# EAGLE design main (EAGLE 7.4.0)
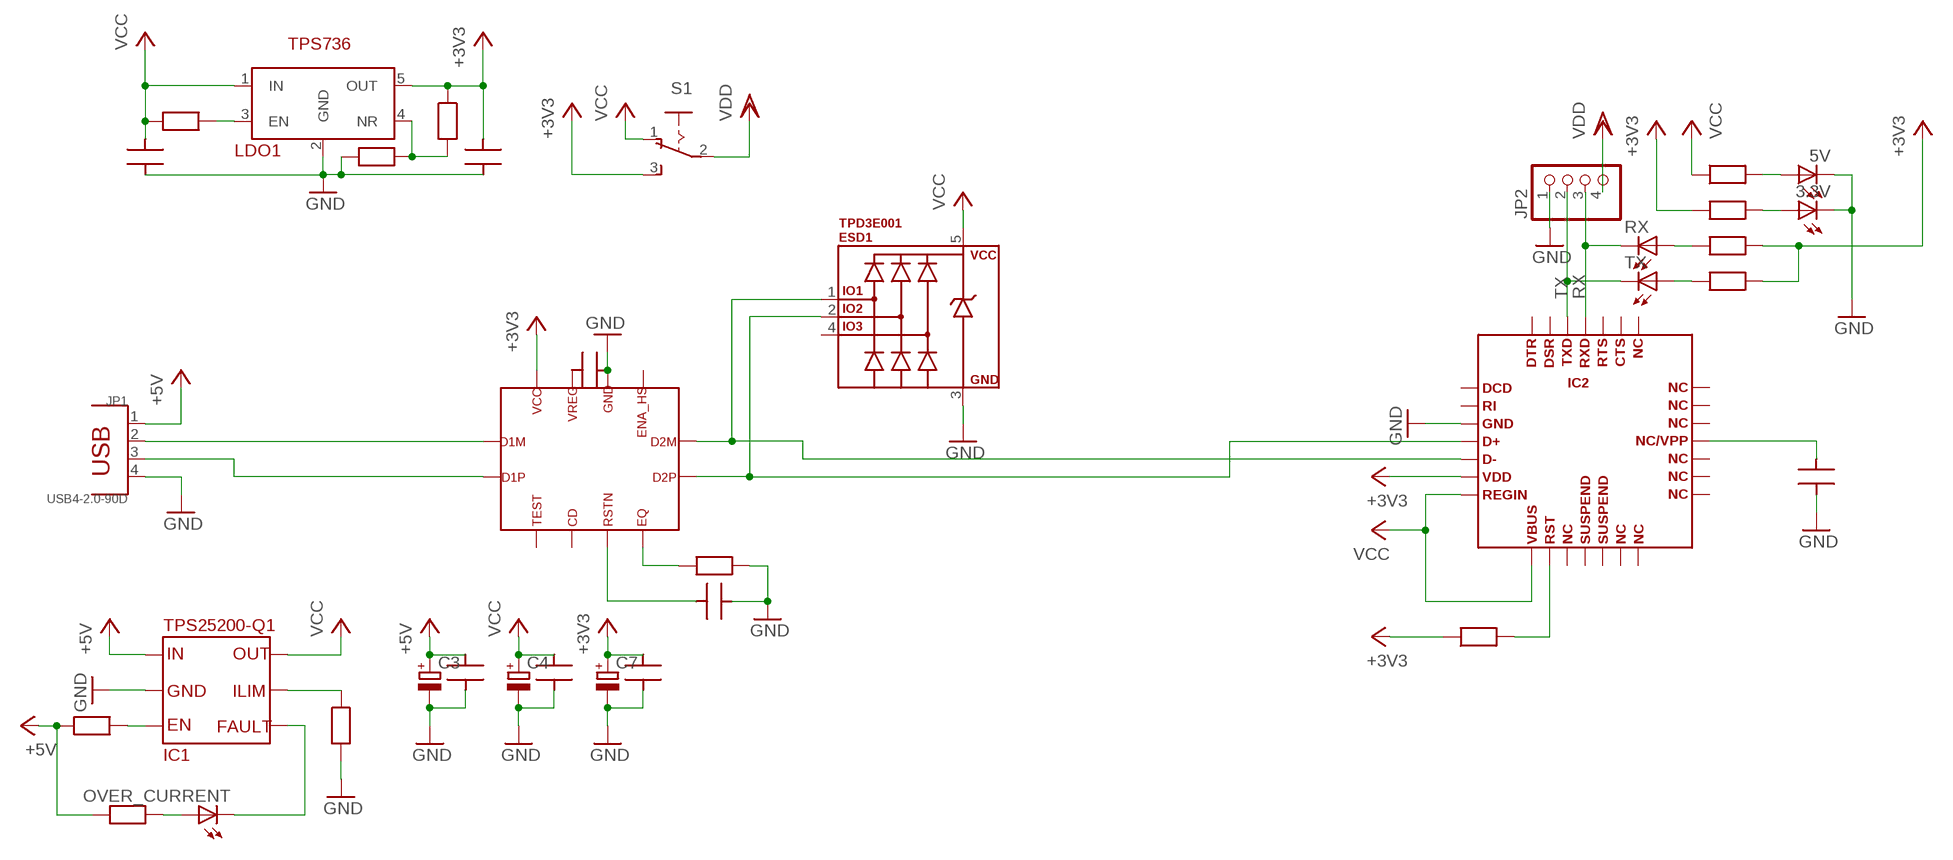
[diagram p0: schematic, sheet 1]

## Parts
3.3V  LEDCHIP-LED0603  [CHIP-LED0603]
5V  LEDCHIP-LED0603  [CHIP-LED0603]
C1  CAP0603  [C0603]
C2  CAP0603  [C0603]
C3  CPOL-EUSMCA  [SMC_A]
C4  CPOL-EUSMCA  [SMC_A]
C5  CAP0603  [C0603]
C6  CAP0603  [C0603]
C7  CPOL-EUSMCA  [SMC_A]
C8  CAP0603  [C0603]
C9  CAP0603  [C0603]
C10  CAP0603  [C0603]
C11  CAP0603  [C0603]
ESD1  TPD3E001  [SOT23-5]
IC1  TPS25200-Q1  [PWSON6]
IC2  CP2102/9  [QFN-28]
JP1  USB4-2.0-90D  DIP-USB-A-TYPE-FMAL(4+2P-2.0-90D)  [USB4+2P-2.0-90D]
JP2  PINHD-1X4  [1X04]
LDO1  TPS736  [SOT23-5]
OVER_CURRENT  LEDCHIP-LED0603  [CHIP-LED0603]
R1  RES0603  [R0603]
R2  RES0603  [R0603]
R3  RES0603  [R0603]
R4  RES0603  [R0603]
R5  RES0603  [R0603]
R6  RES0603  [R0603]
R7  RES0603  [R0603]
R8  RES0603  [R0603]
R9  RES0603  [R0603]
R10  RES0603  [R0603]
R11  RES0603  [R0603]
R12  RES0603  [R0603]
RX  LEDCHIP-LED0603  [CHIP-LED0603]
S1  255SB  [255SB]
TX  LEDCHIP-LED0603  [CHIP-LED0603]
USB1  TUSB211QRWBRQ1  [X2QFN]

## Nets
+3V3: C2.2 C7.+ C8.2 IC2.6 LDO1.5(OUT) R2.1 R7.1 R8.2 R9.2 R10.1 S1.3(S) USB1.12
+5V: C3.+ C5.2 IC1.P$1 JP1.1 R4.2 R12.1
GND: 3.3V.C 5V.C C1.1 C2.1 C3.- C4.- C5.1 C6.1 C7.- C8.1 C9.1 C10.1 C11.2 ESD1.3 IC1.EPAD IC1.P$2 IC2.3 IC2.EPAD_B IC2.EPAD_T IC2.EPAD_VIA1 IC2.EPAD_VIA2 IC2.EPAD_VIA3 IC2.EPAD_VIA4 IC2.EPAD_VIA5 IC2.EPAD_VIA6 IC2.EPAD_VIA7 IC2.EPAD_VIA8 IC2.EPAD_VIA9 JP1.4 JP2.1 LDO1.2(GND) R3.1 R5.2 R6.2 USB1.10
N$1: JP1.2 USB1.1
N$2: JP1.3 USB1.2
N$3: LDO1.3(EN) R1.1
N$4: LDO1.4(NR) R2.2 R3.2
N$5: IC1.P$3 R4.1
N$6: IC1.P$5 R5.1
N$7: ESD1.1 IC2.5 USB1.8
N$8: ESD1.2 IC2.4 USB1.7
N$9: C9.2 USB1.11
N$10: R6.1 USB1.6
N$11: C10.2 USB1.5
N$12: IC2.9 R7.2
N$13: R8.1 RX.A
N$14: R9.1 TX.A
N$15: C11.1 IC2.18
N$16: 3.3V.A R10.2
N$17: OVER_CURRENT.A R12.2
N$18: IC1.P$4 OVER_CURRENT.C
N$19: 5V.A R11.2
RX: IC2.25 JP2.3 RX.C
TX: IC2.26 JP2.2 TX.C
VCC: C1.2 C4.+ C6.2 ESD1.5 IC1.P$6 IC2.7 IC2.8 LDO1.1(IN) R1.2 R11.1 S1.1(O)
VDD: JP2.4 S1.2(P)
Unconnected: ESD1.4 IC2.1 IC2.2 IC2.10 IC2.11 IC2.12 IC2.13 IC2.14 IC2.15 IC2.16 IC2.17 IC2.19 IC2.20 IC2.21 IC2.22 IC2.23 IC2.24 IC2.27 IC2.28 JP1.SG1(GND) JP1.SG2(GND) USB1.3 USB1.4 USB1.9

## Library data of the parts
3.3V 5V OVER_CURRENT RX TX = led:LED: LED OSRAM: - CHIPLED LG R971, LG N971, LY N971, LG Q971, LY Q971, LO R971, LY R971 LH N974, LH R974 LS Q976, LO Q976, LY Q976 LO Q996 - Hyper CHIPLED LW Q18S LB Q993, LB Q99A, LB R99A - SideLED LS A670, LO A670, LY A670, LG A670, LP A670 LB A673, LV A673, LT A673, LW A673 LH A674 LY A675 LS A676, LA A676, LO A676, LY A676, LW A676 LS A679, LY A679, LG A679 - Hyper Micro SIDELED® LS Y876, LA Y876, LO Y876, LY Y876 LT Y87S - SmartLED LW L88C, LW L88S LB L89C, LB L89S, LG L890 LS L89K, LO L89K, LY L89K LS L896, LA L896, LO L896, LY L896 - TOPLED LS T670, LO T670, LY T670, LG T670, LP T670 LSG T670, LSP T670, LSY T670, LOP T670, LYG T670 LG T671, LOG T671, LSG T671 LB T673, LV T673, LT T673, LW T673 LH T674 LS T676, LA T676, LO T676, LY T676, LB T676, LH T676, LSB T676, LW T676 LB T67C, LV T67C, LT T67C, LS T67K, LO T67K, LY T67K, LW E67C LS E67B, LA E67B, LO E67B, LY E67B, LB E67C, LV E67C, LT E67C LW T67C LS T679, LY T679, LG T679 LS T770, LO T770, LY T770, LG T770, LP T770 LB T773, LV T773, LT T773, LW T773 LH T774 LS E675, LA E675, LY E675, LS T675 LS T776, LA T776, LO T776, LY T776, LB T776 LHGB T686 LT T68C, LB T68C - Hyper Mini TOPLED® LB M676 - Mini TOPLED Santana® LG M470 LS M47K, LO M47K, LY M47K Source: http://www.osram.convergy.de LUXEON: - LUMILED® LXK2-PW12-R00, LXK2-PW12-S00, LXK2-PW14-U00, LXK2-PW14-V00 LXK2-PM12-R00, LXK2-PM12-S00, LXK2-PM14-U00 LXK2-PE12-Q00, LXK2-PE12-R00, LXK2-PE12-S00, LXK2-PE14-T00, LXK2-PE14-U00 LXK2-PB12-K00, LXK2-PB12-L00, LXK2-PB12-M00, LXK2-PB14-N00, LXK2-PB14-P00, LXK2-PB14-Q00 LXK2-PR12-L00, LXK2-PR12-M00, LXK2-PR14-Q00, LXK2-PR14-R00 LXK2-PD12-Q00, LXK2-PD12-R00, LXK2-PD12-S00 LXK2-PH12-R00, LXK2-PH12-S00 LXK2-PL12-P00, LXK2-PL12-Q00, LXK2-PL12-R00 Source: www.luxeon.com KINGBRIGHT: KA-3528ASYC Source: www.kingbright.com
C1 C2 C5 C6 C8-C11 = My_RLC:CAP0603: Ceramic Capasitor SMD 0603
C3 C4 C7 = rcl:CPOL-EU: POLARIZED CAPACITOR, European symbol
ESD1 = My_TI:TPD3E001: TPD3E001 Low-Capacitance 3-Channel ESD-Protection for High-Speed Data Interfaces. IEC61000-4-2 Level-4 ESD Protection: – ±8-kV IEC 61000-4-2 Contact Discharge. – ±15-kV IEC 61000-4-2 Air-Gap Discharge. 5.5-A Peak Pulse Current (8/20-µs Pulse). 0.9-V to 5.5-V Supply-Voltage Range. Datasheet <http://www.ti.com/lit/ds/symlink/tpd3e001.pdf>
IC1 = My_TI:TPS25200-Q1: TPS25200-Q1 5-V eFuse With Precision Adjustable Current Limit and Overvoltage Clamp. Datasheet <http://www.ti.com/lit/ds/symlink/tps25200-q1.pdf>
IC2 = Interface:CP2102/9: CP2102/9 SINGLE-CHIP USB TO UART BRIDGE. Integrated USB transceiver; no external resistors requied. Integrated clock; no external crystal required. Internal 1024-byte programmable ROM for vendor ID product ID, serial number, power descriptor, release number, and product description strings. - EEPROM (CP2102). - EPROM (One-time programmable) (CP2109). Datasheet <https://www.silabs.com/Support%20Documents/TechnicalDocs/CP2102-9.pdf>
JP1 = Seeed-OPL-Connector:DIP-USB-A-TYPE-FMAL(4+2P-2.0-90D): 320010007
JP2 = pinhead:PINHD-1X4: PIN HEADER
LDO1 = My_TI:TPS736: TPS73632DBVT Cap-Free, NMOS, 400-mA Low-Dropout Regulator with Reverse Current Protection Input Voltage Range of 1.7 V to 5.5 V Ultra-Low Dropout Voltage: 75 mV typ Low Noise: 30 μVRMS typ (10 Hz to 100 kHz) Dtasheet <http://www.ti.com/lit/ds/symlink/tps736.pdf>
R1-R12 = My_RLC:RES0603: Resistor SMD 0603
S1 = switch:255SB: SLIDING SWITCH Distributor Buerklin, 11G810
USB1 = My_TI:TUSB211QRWBRQ1: TUSB211 USB 2.0 High Speed Signal Conditioner Compatible with USB 2.0, OTG 2.0 and BC 1.2 Active Power Consumption of 55 mW (Typical) with 3.3-V Single Supply Datasheet <http://www.ti.com/lit/ds/symlink/tusb211-q1.pdf>

## Board
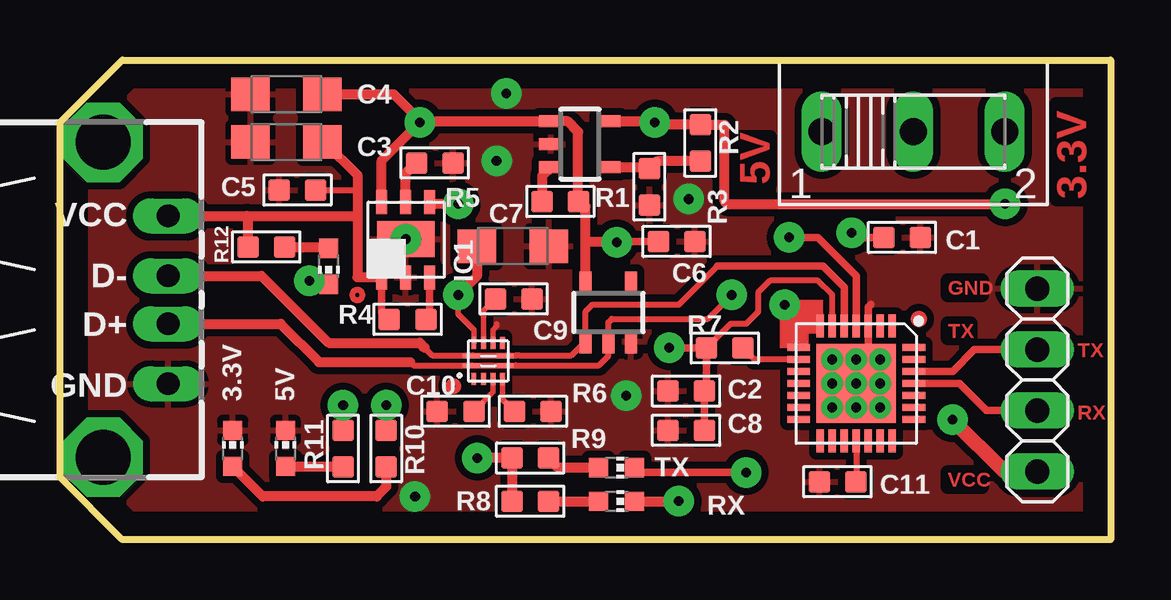
[diagram p1: board, top side]
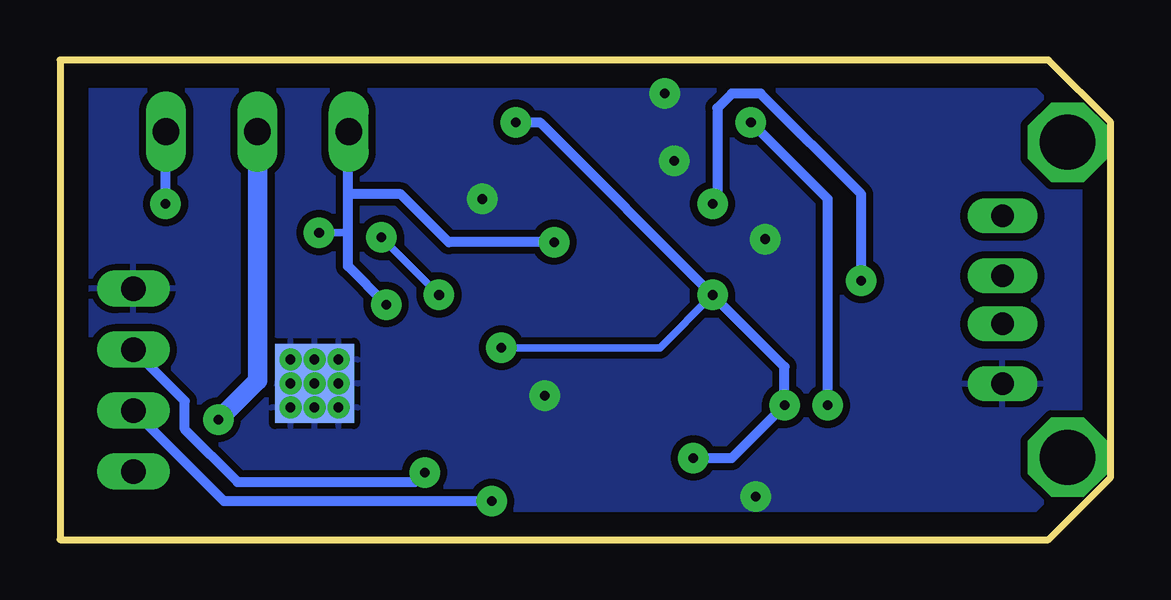
[diagram p2: board, bottom side, seen from below]

Size 43.8 x 20 mm. Coordinates in mm from the lower left corner, seen from the top.
Outline: 0,2.6 0,17.4 2.6,20 43.8,20 43.8,0 2.6,0 0,2.6
Copper layers (1*16): Top 0.035mm / dielectric 1.5mm / Bottom 0.035mm
Design rules "default": minimum track width 10mil, minimum drill 24mil, track to track 8mil, track to pad 8mil, pad to pad 8mil, via to via 8mil, smd to smd 8mil, copper to edge 40mil, drill to drill 8mil, minimum pad ring 10mil, minimum via ring 8mil, stop-mask expansion 4mil, vias tented up to drill 0mil, thermal gap 10mil

### Footprints (pad centres in the part's own frame; a part is rotated, then mirrored left to right if it is on the bottom)
CHIP-LED0603 = smd 0.8 x 0.8: A 0,-0.75; C 0,0.75
C0603 = smd 0.889 x 0.889: 1 0,0.762; 2 0,-0.762
SMC_A = smd 1.6 x 1.4: + -1.5,0; - 1.5,0
SOT23-5 = smd 0.5 x 1: 1 -0.95,-1.2; 2 0,-1.2; 3 0.95,-1.2; 4 0.95,1.2; 5 -0.95,1.2
PWSON6 = smd 1.5 x 2.4: EPAD 0,0 | smd 1 x 0.45: P$1 -1.6,1; P$2 -1.6,0; P$3 -1.6,-1; P$4 1.55,-1; P$5 1.55,0; P$6 1.55,1
QFN-28 = smd 0.95 x 0.3: 1 -2.4,1.5; 2 -2.4,1; 3 -2.4,0.5; 4 -2.4,0; 5 -2.4,-0.5; 6 -2.4,-1; 7 -2.4,-1.5; 15 2.4,-1.5; 16 2.4,-1; 17 2.4,-0.5; 18 2.4,0; 19 2.4,0.5; 20 2.4,1; 21 2.4,1.5 | smd 0.3 x 0.95: 8 -1.5,-2.4; 9 -1,-2.4; 10 -0.5,-2.4; 11 0,-2.4; 12 0.5,-2.4; 13 1,-2.4; 14 1.5,-2.4; 22 1.5,2.4; 23 1,2.4; 24 0.5,2.4; 25 0,2.4; 26 -0.5,2.4; 27 -1,2.4; 28 -1.5,2.4 | smd 3.3 x 3.3 bottom: EPAD_B 0,0 | smd 3.3 x 3.3: EPAD_T 0,0 | drill 0.4: EPAD_VIA1 -1,1; EPAD_VIA2 0,1; EPAD_VIA3 1,1; EPAD_VIA4 1,0; EPAD_VIA5 0,0; EPAD_VIA6 -1,0; EPAD_VIA7 -1,-1; EPAD_VIA8 0,-1; EPAD_VIA9 1,-1
USB4+2P-2.0-90D = drill 0.95 long: 1 -3.5,2.71; 2 -1,2.71; 3 1,2.71; 4 3.5,2.71 | drill 2.3 octagon: SG1 -6.57,0; SG2 6.57,0
1X04 = drill 1.016 long: 1 -3.81,0; 2 -1.27,0; 3 1.27,0; 4 3.81,0
R0603 = smd 0.889 x 0.889: 1 0,0.762; 2 0,-0.762
255SB = drill 1.118 long: 1 -3.81,0; 2 0,0; 3 3.81,0
X2QFN = smd 0.7 x 0.2: 1 -0.7,0.2; 2 -0.7,-0.2; 7 0.7,-0.2; 8 0.7,0.2 | smd 0.2 x 0.5: 3 -0.6,-0.75; 4 -0.2,-0.75; 5 0.2,-0.75; 6 0.6,-0.75; 9 0.6,0.75; 10 0.2,0.75; 11 -0.2,0.75; 12 -0.6,0.75

### Placement (x,y rotation side)
3.3V  7.2,3.8 0 top
5V  9.4,3.8 0 top
C1  35.1,12.6 270 top
C2  26.1,6.19 90 top
C3  9.44,16.58 180 top
C4  9.44,18.57 180 top
C5  9.9,14.58 90 top
C6  25.7,12.43 270 top
C7  18.88,12.23 0 top
C8  26.1,4.56 90 top
C9  18.91,10.04 270 top
C10  16.49,5.35 90 top
C11  32.41,2.41 270 top
ESD1  22.86,9.47 0 top
IC1  14.41,12.53 90 top
IC2  33.19,6.51 270 top
JP1  1.8,10 270 top
JP2  40.74,6.65 270 top
LDO1  21.67,16.49 270 top
OVER_CURRENT  11.2,11.4 180 top
R1  20.86,14.1 90 top
R2  26.69,16.54 0 top
R3  24.57,14.71 180 top
R4  14.49,9.18 270 top
R5  15.62,15.7 90 top
R6  19.71,5.35 90 top
R7  27.71,7.99 90 top
R8  19.6,1.6 270 top
R9  19.6,3.4 270 top
R10  13.6,3.8 0 top
R11  11.8,3.8 0 top
R12  8.6,12.2 90 top
RX  23.2,1.6 270 top
S1  35.57,17.01 0 top
TX  23.2,3 270 top
USB1  17.85,7.45 0 top

### Tracks (layer width: path | path; a pad name or v marks a point on that pad's centre or on a via)
+3V3  (via drill 0.4 pad 1.27)
  Top 0.22: v16.6,10.2 16.6,9.4 17.25,8.75 USB1.12
  Top 0.254: IC2.6 32.19,10.21 31.6,10.8 29.6,10.8 29.1,10.3 29.1,9.5 28.6,9 27.96,9 R7.1
  Top 0.305: v25.4,8 v25.41,7.99 R7.1 26.95,6.28 C2.2 C8.2
  Top 0.406: LDO1.5 24.76,17.44 v24.8,17.4 24.9,17.3 R2.1 27.7,17.3 27.7,14.1 27.8,14 v39.4,14 | C7.+ 17.38,10.98 v16.6,10.2 | R10.1 v13.6,5.6 | R8.2 R9.2 v17.4,3.4
  Bottom 0.305: v25.4,8 18.8,8 v16.6,10.2
  Bottom 0.406: v24.8,17.4 23.8,17.4 v16.6,10.2 13.6,7.2 v13.6,5.6 15.8,3.4 v17.4,3.4 | v39.4,14 39.4,16.99 S1.3
+5V
  Top 0.254: C5.2 12.38,14.58 12.4,14.6
  Top 0.305: IC1.P$1 13.41,9.5 R4.2
  Top 0.406: IC1.P$1 12.4,10.93 12.4,13.4 | C3.+ 11.02,16.58 12.4,15.2 12.4,14.6 12.4,13.4 | JP1.1 7.8,13.5 | 7.8,13.5 12.3,13.5 12.4,13.4 | R12.1 7.84,13.46 7.8,13.5
  Bottom 0.406: 5,13.99 JP1.1
GND  (via drill 0.4 pad 1.27)
  Top 0.22: USB1.10 18.05,8.75 18.2,8.9 18.2,9
  Top 0.305: 33.8,9.8 33.69,9.69 IC2.3 33.69,8.14 33.68,8.13 33.68,7.14 33.31,7.51 IC2.EPAD_VIA6 | IC2.EPAD_VIA6 IC2.EPAD_VIA1 | IC2.EPAD_VIA6 IC2.EPAD_VIA7 | IC2.EPAD_VIA8 IC2.EPAD_VIA9 | IC2.EPAD_VIA4 IC2.EPAD_VIA3
  other vias: 18.2,15.8 26.2,14.2 23.6,6 14.8,1.8 14.41,12.53 18.6,18.6
  pour Top (isolate 0.3): 0,20 43.8,20 43.8,0 0,0
  pour Bottom (isolate 0.3): 43.8,20 0,20 0,0 43.8,0
N$1
  Top 0.1: USB1.1 17.18,7.68 17.2,7.68
  Top 0.254: 15.2,8 15.52,7.68 17.2,7.68 19.05,7.68
  Top 0.406: JP1.2 8.4,11 11.2,8.2 15,8.2 15.2,8
N$2
  Top 0.1: USB1.2 17.17,7.27
  Top 0.254: 14.6,7.4 14.73,7.27 17.17,7.27 19,7.27
  Top 0.406: JP1.3 9.2,9 10.8,7.4 14.6,7.4
N$3
  Top 0.406: LDO1.3 20.1,15.17 R1.1
N$4
  Top 0.406: LDO1.4 24.5,15.54 R3.2 24.88,15.78 R2.2
N$5
  Top 0.305: IC1.P$3 15.41,9.34 R4.1
N$6
  Top 0.406: IC1.P$5 14.41,15.25 R5.1
N$7
  Top 0.1: USB1.8 18.58,7.68 19.03,7.68
  Top 0.254: 27.4,11.4 25.8,9.8 22.2,9.8 21.91,9.51 ESD1.1 21.32,7.68 19.13,7.68 19.03,7.68
  Top 0.305: 27.4,11.4 31.8,11.4 32.69,10.51 IC2.5
N$8  (via drill 0.4 pad 1.27)
  Top 0.1: USB1.7 18.57,7.27 19,7.27
  Top 0.254: v28,10.2 27,9.2 23,9.2 22.86,9.06 ESD1.2 22.86,7.66 22.47,7.27 19,7.27
  Top 0.305: IC2.4 33.2,11 31.6,12.6 v30.4,12.6
  Bottom 0.305: v28,10.2 v30.4,12.6
N$9
  Top 0.22: USB1.11 17.65,9.54 C9.2
N$10
  Top 0.22: USB1.6 18.45,5.85 R6.1
N$11
  Top 0.22: USB1.5 18.05,6.15 C10.2
N$12
  Top 0.254: IC2.9 28.95,7.51 R7.2
N$13
  Top 0.406: R8.1 RX.A
N$14
  Top 0.406: TX.A 20.76,3 R9.1
N$15
  Top 0.254: IC2.18 33.19,2.43 C11.1
N$16
  Top 0.406: R10.2 13.6,2.2 13.2,1.8 8.45,1.8 3.3V.A
N$17
  Top 0.406: R12.2 11.15,12.2 OVER_CURRENT.A
N$18  (via drill 0.4 pad 1.27)
  Top 0.406: OVER_CURRENT.C 10.55,10.65 v10.4,10.8 | v16.6,14 15.49,14 IC1.P$4
  Bottom 0.406: v10.4,10.8 10.4,14.4 14.6,18.6 15.8,18.6 16.4,18 16.4,14.2 v16.6,14
N$19
  Top 0.406: R11.2 9.41,3.04 5V.A
RX  (via drill 0.4 pad 1.27)
  Top 0.305: IC2.25 37.49,6.51 38.62,5.38 JP2.3
  Top 0.406: RX.C v25.8,1.6
  Bottom 0.406: v25.8,1.6 36.96,1.6 JP2.3
TX  (via drill 0.4 pad 1.27)
  Top 0.305: IC2.26 37.21,7.01 38.12,7.92 JP2.2 | TX.C 24,3 24.2,2.8 v28.6,2.8
  Bottom 0.406: JP2.2 38.6,5.78 38.6,4.6 36.4,2.4 29,2.4 v28.6,2.8
VCC  (via drill 0.4 pad 1.27)
  Top 0.254: IC2.7 31.09,8.91 | 31.09,8.91 v30.2,9.8 | IC2.8 30.79,8.61 31.09,8.91
  Top 0.305: C1.2 33.2,12.6 v33,12.8 | C6.2 23.23,12.43 v23.2,12.4
  Top 0.406: IC1.P$6 13.41,15.81 v15,17.4 | v15,17.4 15.04,17.44 | 15.04,17.44 15.6,17.44 | 15.6,17.44 LDO1.1 21.16,17.44 21.6,17 21.6,14.2 21.62,14.18 | ESD1.5 21.91,12.4 | 21.91,12.4 21.91,13.89 21.62,14.18 | 21.62,14.18 R1.2 | C4.+ 13.91,18.57 15.04,17.44 | v23.2,12.4 21.91,12.4 | R11.1 v11.8,5.6 | v15,17.4 15.56,17.4 15.6,17.44
  Bottom 0.305: v33,12.8 31.8,12.8
  Bottom 0.406: v30.2,9.8 31.8,11.4 31.8,12.8 31.8,14.4 | 31.8,14.4 31.8,16.97 S1.1 | v23.2,12.4 27.6,12.4 29.6,14.4 31.8,14.4 | v11.8,5.6 11.8,14.2 v15,17.4
VDD  (via drill 0.4 pad 1.27)
  Top 0.61: JP2.4 39.36,2.84 v37.2,5
  Bottom 0.813: S1.2 35.57,6.63 v37.2,5
(copper drawn outside any net)
  shapes: Top area x2, Top circle x3

### Text on the board
Top: 5V | 3.3V | GND | TX | TX | RX | VCC
tStop: 5V | 3.3V | GND | TX | TX | RX | VCC